# Altium schematic sheet mpc57_can.SchDoc: CAN Transceivers
size Letter; Organization: NewAE Technology Inc.; Address1: 1083 Queen St., Suite 196; Address2: Halifax; Address3: NS; Address4: Canada B3H 0B2; SheetApproved: YES
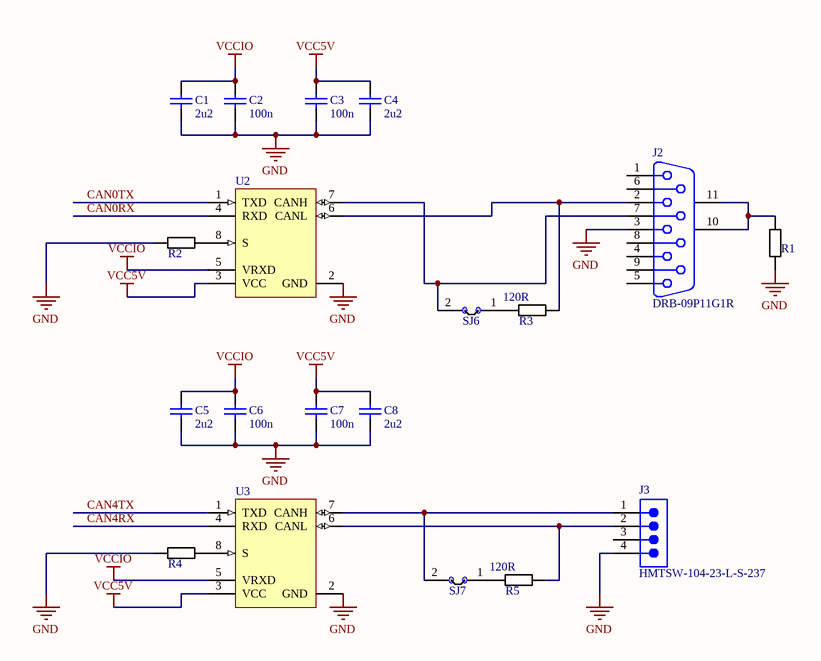
[diagram p0: mpc57_can.SchDoc]

## Parts
C1  2u2  [CAPC0603_M]
C2  100n  [CAPC0402_M]
C3  100n  [CAPC0402_M]
C4  2u2  [CAPC0603_M]
C5  2u2  [CAPC0603_M]
C6  100n  [CAPC0402_M]
C7  100n  [CAPC0402_M]
C8  2u2  [CAPC0603_M]
J2  DRB-09P11G1R  [TAIT-DRB-09P11G1R_V]
J3  HMTSW-104-23-L-S-237  [SMTC-HMTSW-104-23-X-S-237]
R1  10R  [RESC1608X55N]  (value not drawn)
R2  4k7  [RESC1608X55N]  (value not drawn)
R3  120R  [RESC1608X55N]
R4  4k7  [RESC1608X55N]  (value not drawn)
R5  120R  [RESC1608X55N]
SJ6  NC  [SJ_2S_NC]  (value not drawn)  (no BOM)
SJ7  NC  [SJ_2S_NC]  (value not drawn)  (no BOM)
U2  TJA1051T/3  [SOIC8_NARROW]  (value not drawn)
U3  TJA1051T/3  [SOIC8_NARROW]  (value not drawn)

## Nets
GND: C1.2 C2.2 C3.2 C4.2 C5.2 C6.2 C7.2 C8.2 J2.3 J3.4 R1.1 R2.1 R4.1 U2.2(GND) U3.2(GND)
VCC5V: C3.1 C4.1 C7.1 C8.1 U2.3(VCC) U3.3(VCC)
VCCIO: C1.1 C2.1 C5.1 C6.1 U2.5(VRXD) U3.5(VRXD)
CAN0RX: U2.4(RXD)
CAN0TX: U2.1(TXD)
CAN4RX: U3.4(RXD)
CAN4TX: U3.1(TXD)
NetJ2_2: J2.2 R3.2 U2.6(CANL)
NetJ2_7: J2.7 SJ6.2 U2.7(CANH)
NetJ2_10: J2.10(MH1) J2.11(MH2) R1.2
NetJ3_1: J3.1 SJ7.2 U3.7(CANH)
NetJ3_2: J3.2 R5.2 U3.6(CANL)
NetR2_2: R2.2 U2.8(S)
NetR3_1: R3.1 SJ6.1
NetR4_2: R4.2 U3.8(S)
NetR5_1: R5.1 SJ7.1

Not connected (* = marked no-connect by the designer): J2 1 4 5 6 8 9; J3 3

## Notes on the sheet
- Title:
- Date:
- Rev:
- Time:
- Project:
- Sheet
- of
- License:
- Copyright © NewAE Technology Inc.
- Approved:
- NewAE.com
- File:

## Library data of the parts
C1 C4 C5 C8 = CCHIP-2u2-0603: 2u2, 0603; Case-EIA: 0603; Case-Metric: 1608; Part Number: CCHIP-2u2-0603; Component Kind: Standard; Component Type: Standard; Footprint: 0603; Pin Count: 2; Value: 2u2; Mounting Technology: SMT
C2 C3 C6 C7 = CCHIP-100n-0402: 100n, 0402; Case-EIA: 0402; Part Number: CCHIP-100n-0402; Component Kind: Standard; Component Type: Standard; Footprint: 0402; Pin Count: 2; Value: 100n; Mounting Technology: SMT
J2 = CMP-0264-00001-1: DB9 R/A Connector, Through-hole, Male; ComponentLink1URL: http://www.taitek.com/; ComponentLink2URL: http://www.taitek.com/connects_prod_info.asp?id=A100011; PartNumber: DRB-09P11G1R; PackageDescription: 9-Pin D-Sub R/A  Male Connector, 2.77 mm Pitch; ComponentLink2Description: Datasheet; Mounting Technology: Through Hole; PackageReference: DRB-09P11G1R; ComponentLink1Description: Manufacturer URL
J3 = CMP-1024-00020-1: Manufacturer: Samtec; Pitch: 2.54 mm; ComponentLink3URL: http://www.samtec.com/documents/webfiles/cpdf/HMTSW-XXX-XX-X-X-XXXX-XX-XX-MKT1.pdf; PartNumber: HMTSW-104-23-L-S-237; Temperature Range: -55 to 125 degC; ComponentLink1Description: Manufacturer URL; Orientation: Vertical; ComponentLink3Description: Package Specification; ComponentLink2URL: http://www.samtec.com/documents/webfiles/pdf/HMTSW.PDF; DatasheetVersion: F-214; PackageDescription: Assembly .025 [.64] SQ. Post Hi-Temp Terminal Strip; ComponentLink1URL: http://www.samtec.com; PackageReference: HMTSW-104-23-X-S-237; RoHS: True; Mounting Technology: Through-hole; ComponentLink2Description: Datasheet; PackageVersion: AL, 3/1987
R1 = RCHIP-10R-0603: 10R res, 0603, 1%, 1/10W; Manufacture 1: Yageo; Manufacture Part Number 1: RC0603FR-0710RL; Case-EIA: 0603; Case-Metric: 1608; Rated Power: 0.1W; Rated Voltage: 75VDC; Part Number: RCHIP-10R-0603; Component Kind: Standard; Component Type: Standard; Footprint: 0603; Pin Count: 2; Supplier 1: Digi-Key; Supplier Part Number 1: 311-10.0HRCT-ND; Value: 10R; Tolerance: 1%; Mounting Technology: SMT; Temperature Range: -55C to 155C
R2 R4 = RCHIP-4K7-0603: 4k7 res, 0603, 1%, 1/10W; Manufacture 1: Yageo; Manufacture Part Number 1: RC0603FR-074K7L; Case-EIA: 0603; Case-Metric: 1608; Rated Power: 0.1W; Rated Voltage: 75VDC; Part Number: RCHIP-4K7-0603; Component Kind: Standard; Component Type: Standard; Footprint: 0603; Pin Count: 2; Supplier 1: Digi-Key; Supplier Part Number 1: 311-4.70KHRCT-ND; Value: 4k7; Tolerance: 1%; Mounting Technology: SMT; Temperature Range: -55C to 155C
R3 R5 = RCHIP-120R-0603: 120R res, 0603, 1%, 1/10W; Manufacture 1: Yageo; Manufacture Part Number 1: RC0603FR-07120RL; Case-EIA: 0603; Case-Metric: 1608; Rated Power: 0.1W; Rated Voltage: 75VDC; Part Number: RCHIP-120R-0603; Component Kind: Standard; Component Type: Standard; Footprint: 0603; Pin Count: 2; Supplier 1: Digi-Key; Supplier Part Number 1: 311-120HRCT-ND; Value: 120R; Tolerance: 1%; Mounting Technology: SMT; Temperature Range: -55C to 155C
SJ6 SJ7 = SJ_2S: Solder Jumper, NC; Part Number: SJ_2S; Component Type: Standard (No BOM); Pin Count: 2
U2 U3 = TJA1051T_3: CAN-FD Transceiver, 3.3V; Part Number: TJA1051T_3; Component Kind: Standard; Component Type: Standard; Footprint: SOIC8-NARROW; Pin Count: 8; Supplier 1: Digi-Key; Supplier Part Number 1: 568-8684-1-ND; ComponentLink1Description: Datasheet; ComponentLink1URL: http://www.nxp.com/documents/data_sheet/TJA1051.pdf; Mounting Technology: Surface Mount